# EAGLE design powerSupply (EAGLE 7.3.0)
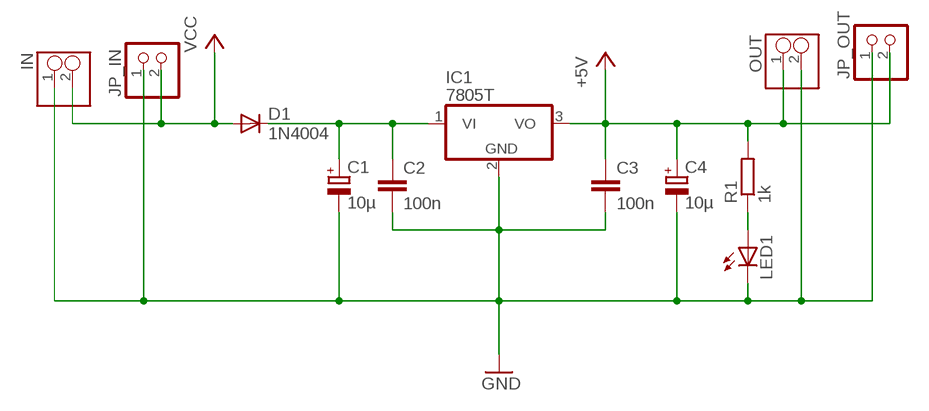
[diagram p0: schematic, sheet 1]

## Parts
C1  10µ  CPOL-EUE2.5-6  [E2,5-6]
C2  100n  C-EU025-024X044  [C025-024X044]
C3  100n  C-EU025-024X044  [C025-024X044]
C4  10µ  CPOL-EUE2.5-6  [E2,5-6]
D1  1N4004  [DO41-10]
IC1  7805T  [TO220H]
IN  GENERIC-1X2_PINWAGO-5MM  [WAGO-5MM-2_PIN]
JP_IN  PINHD-1X2  [1X02]
JP_OUT  PINHD-1X2  [1X02]
LED1  LED3MM  [LED3MM]
OUT  GENERIC-1X2_PINWAGO-5MM  [WAGO-5MM-2_PIN]
R1  1k  R-EU_0207/7  [0207/7]

## Nets
+5V: C3.1 C4.+ IC1.3(VO) JP_OUT.2 OUT.1 R1.2
GND: C1.- C2.2 C3.2 C4.- IC1.2(GND) IN.1 JP_IN.1 JP_OUT.1 LED1.K(C) OUT.2
N$1: C1.+ C2.1 D1.C IC1.1(VI)
N$4: LED1.A R1.1
VCC: D1.A IN.2 JP_IN.2

## Library data of the parts
C1 C4 = rcl:CPOL-EU: POLARIZED CAPACITOR, European symbol
C2 C3 = rcl:C-EU: CAPACITOR, European symbol
D1 = diode:1N4004: DIODE general purpose rectifier, 1 A
IC1 = linear:78*: Positive VOLTAGE REGULATOR Source: http://cache.national.com/ds/LM/LM78L05.pdf http://www.fairchildsemi.com/ds/LM/LM7805.pdf
IN OUT = p.peter-connectors:GENERIC-1X2_PIN
JP_IN JP_OUT = pinhead:PINHD-1X2: PIN HEADER
LED1 = led:LED: LED OSRAM: - CHIPLED LG R971, LG N971, LY N971, LG Q971, LY Q971, LO R971, LY R971 LH N974, LH R974 LS Q976, LO Q976, LY Q976 LO Q996 - Hyper CHIPLED LW Q18S LB Q993, LB Q99A, LB R99A - SideLED LS A670, LO A670, LY A670, LG A670, LP A670 LB A673, LV A673, LT A673, LW A673 LH A674 LY A675 LS A676, LA A676, LO A676, LY A676, LW A676 LS A679, LY A679, LG A679 - Hyper Micro SIDELED® LS Y876, LA Y876, LO Y876, LY Y876 LT Y87S - SmartLED LW L88C, LW L88S LB L89C, LB L89S, LG L890 LS L89K, LO L89K, LY L89K LS L896, LA L896, LO L896, LY L896 - TOPLED LS T670, LO T670, LY T670, LG T670, LP T670 LSG T670, LSP T670, LSY T670, LOP T670, LYG T670 LG T671, LOG T671, LSG T671 LB T673, LV T673, LT T673, LW T673 LH T674 LS T676, LA T676, LO T676, LY T676, LB T676, LH T676, LSB T676, LW T676 LB T67C, LV T67C, LT T67C, LS T67K, LO T67K, LY T67K, LW E67C LS E67B, LA E67B, LO E67B, LY E67B, LB E67C, LV E67C, LT E67C LW T67C LS T679, LY T679, LG T679 LS T770, LO T770, LY T770, LG T770, LP T770 LB T773, LV T773, LT T773, LW T773 LH T774 LS E675, LA E675, LY E675, LS T675 LS T776, LA T776, LO T776, LY T776, LB T776 LHGB T686 LT T68C, LB T68C - Hyper Mini TOPLED® LB M676 - Mini TOPLED Santana® LG M470 LS M47K, LO M47K, LY M47K Source: http://www.osram.convergy.de LUXEON: - LUMILED® LXK2-PW12-R00, LXK2-PW12-S00, LXK2-PW14-U00, LXK2-PW14-V00 LXK2-PM12-R00, LXK2-PM12-S00, LXK2-PM14-U00 LXK2-PE12-Q00, LXK2-PE12-R00, LXK2-PE12-S00, LXK2-PE14-T00, LXK2-PE14-U00 LXK2-PB12-K00, LXK2-PB12-L00, LXK2-PB12-M00, LXK2-PB14-N00, LXK2-PB14-P00, LXK2-PB14-Q00 LXK2-PR12-L00, LXK2-PR12-M00, LXK2-PR14-Q00, LXK2-PR14-R00 LXK2-PD12-Q00, LXK2-PD12-R00, LXK2-PD12-S00 LXK2-PH12-R00, LXK2-PH12-S00 LXK2-PL12-P00, LXK2-PL12-Q00, LXK2-PL12-R00 Source: www.luxeon.com KINGBRIGHT: KA-3528ASYC Source: www.kingbright.com
R1 = rcl:R-EU_: RESISTOR, European symbol

## Board
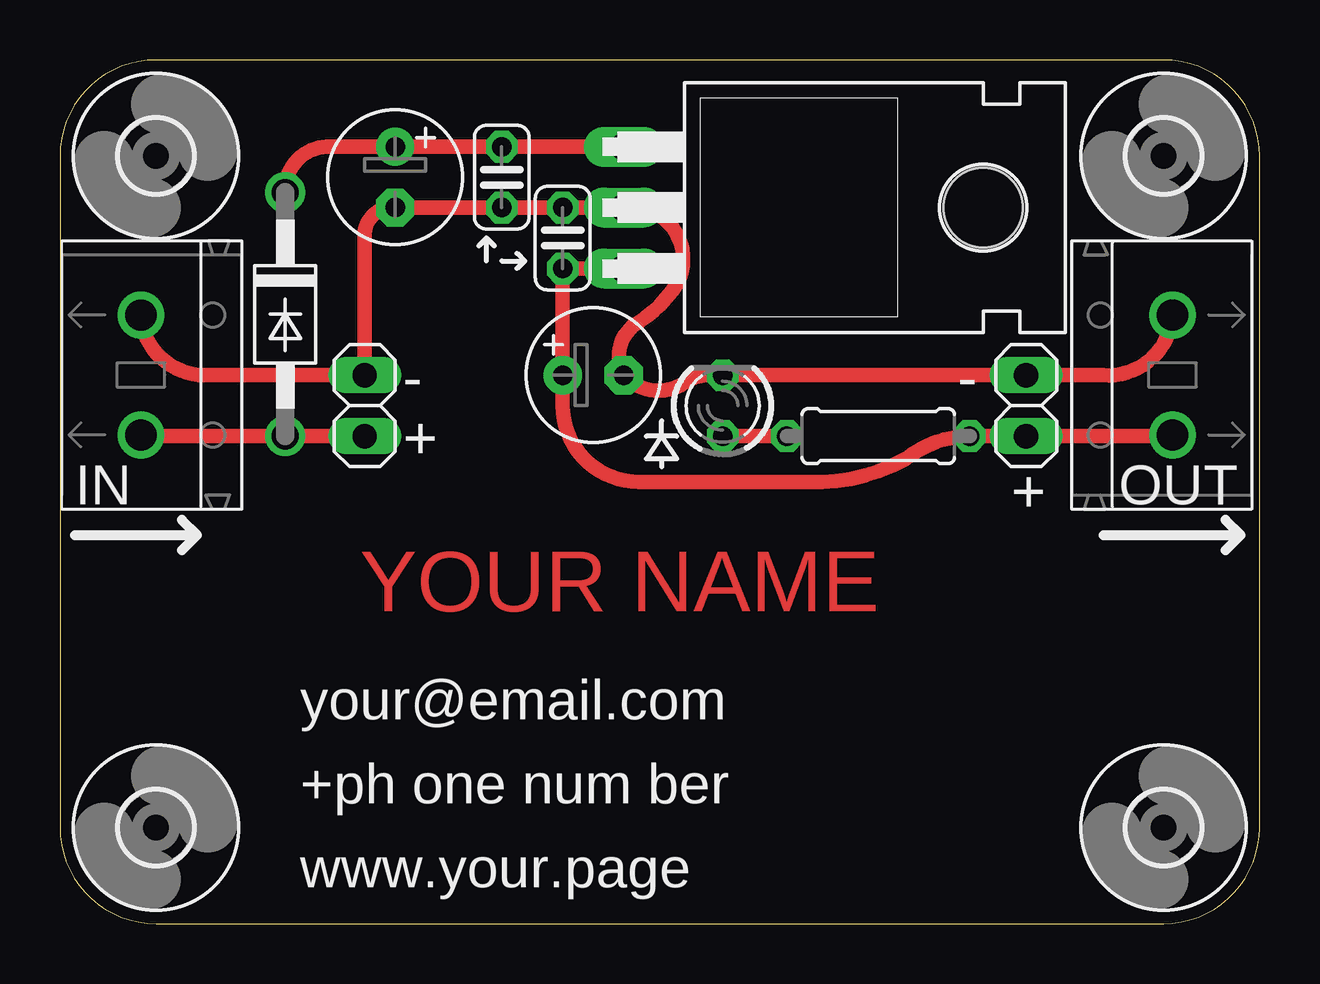
[diagram p1: board, top side]
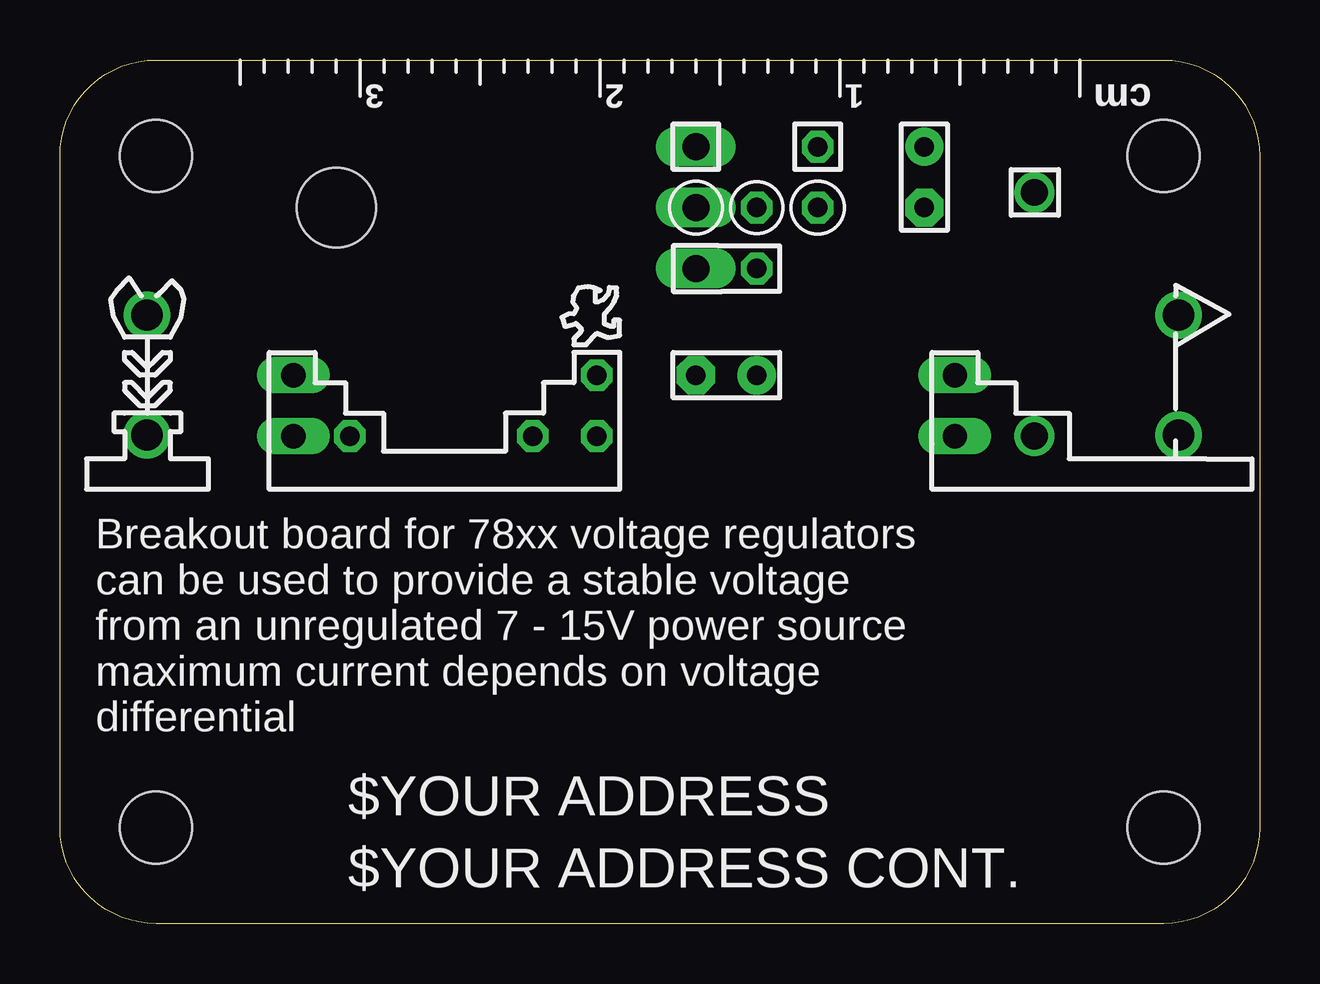
[diagram p2: board, bottom side, seen from below]

Size 50 x 36 mm. Coordinates in mm from the lower left corner, seen from the top.
Outline: 46,0 arc90 50,4 50,32 arc90 46,36 4,36 arc90 0,32 0,4 arc90 4,0 46,0
Copper layers (1*16): Top 0.035mm / dielectric 1.5mm / Bottom 0.035mm
Design rules "Fusion_eagle_rule_v1.1 *": minimum track width 6mil, minimum drill 12mil, track to track 6mil, track to pad 6mil, pad to pad 6mil, via to via 6mil, smd to smd 0mil, copper to edge 10mil, drill to drill 10mil, minimum pad ring 10mil, minimum via ring 6mil, stop-mask expansion 2mil, vias tented up to drill 100mil, thermal gap 10mil

### Footprints (pad centres in the part's own frame; a part is rotated, then mirrored left to right if it is on the bottom)
E2,5-6 = drill 0.813 pad 1.6: + -1.27,0 | drill 0.813 pad 1.6 octagon: - 1.27,0
C025-024X044 = drill 0.813 octagon: 1 -1.27,0; 2 1.27,0
DO41-10 = drill 1.118: A 5.08,0; C -5.08,0
TO220H = drill 1.118 long: 1 -2.54,-10.16; 2 0,-10.16; 3 2.54,-10.16 | hole 3.302: 0,4.826
WAGO-5MM-2_PIN = drill 1.3: 1 -2.5,0; 2 2.5,0
1X02 = drill 1.016 long: 1 -1.27,0; 2 1.27,0
LED3MM = drill 0.813 octagon: A -1.27,0; K 1.27,0
0207/7 = drill 0.813 octagon: 1 -3.81,0; 2 3.81,0
3,0 = hole 3: 0,0

### Placement (x,y rotation side)
C1  13.97,31.11 270 top
C2  18.41,31.11 270 top
C3  20.95,28.57 90 top
C4  22.23,22.86 0 top
D1  9.39,25.4 270 top
IC1  33.66,29.84 270 top
IN  3.37,22.87 270 top
JP_IN  12.7,21.59 270 top
JP_OUT  40.27,21.59 270 top
LED1  27.62,21.59 90 top
OUT  46.37,22.87 90 top
R1  34.11,20.32 0 top
U$1  [3,0]  46,32 0 top
U$2  [3,0]  4,32 0 top
U$3  [3,0]  4,4 0 top
U$5  [3,0]  46,4 0 top

### Tracks (layer width: path | path; a pad name or v marks a point on that pad's centre or on a via)
+5V
  Top 0.61: IC1.3 C3.1 C4.+ 20.95,21.59 arc90 24.13,18.41 31.75,18.41 arc28 35.24,19.37 arc-37 R1.2 JP_OUT.2 46.35,20.32 arc90 46.37,20.34 OUT.1
GND
  Top 0.61: OUT.2 arc-90 43.49,22.86 42.86,22.86 JP_OUT.1 LED1.K arc42 26.04,22.54 arc-82 C4.- arc-88 24.13,25.08 arc26 25.72,26.67 arc127 IC1.2 C3.2 C2.2 15.24,29.84 C1.- arc90 12.7,28.83 JP_IN.1 7.94,22.86 6.03,22.86 arc-87 IN.1
N$1
  Top 0.61: IC1.1 C2.1 C1.+ 11.11,32.38 arc90 D1.C
N$4
  Top 0.61: LED1.A R1.1
VCC
  Top 0.61: JP_IN.2 D1.A 4.45,20.32 3.81,20.32 3.42,20.32 arc-90 IN.2

### Text on the board
Top: YOUR NAME
tPlace: - | - | + | IN | + | OUT | your@email.com | +ph one num ber | www.your.page
bPlace: cm | 1 | 2 | 3 | Breakout board for 78xx voltage regulators / can be used to provide a stable voltage / from an unregulated 7 - 15V power source / maximum current depends on voltage / differential | $YOUR ADDRESS | $YOUR ADDRESS CONT.
tStop: YOUR NAME